# Altium schematic sheet Regulators.SchDoc
size Letter; CompanyName: Ploopy Corporation; Organization: Ploopy Corporation; Address1: Suite 226, 137-1140 Burnhamthorpe Road W; Address2: Mississauga; Address3: Ontario; Address4: Canada L5C 0A3; DocumentNumber: 11; Revision: R1.007; SheetNumber: 11; SheetTotal: 11
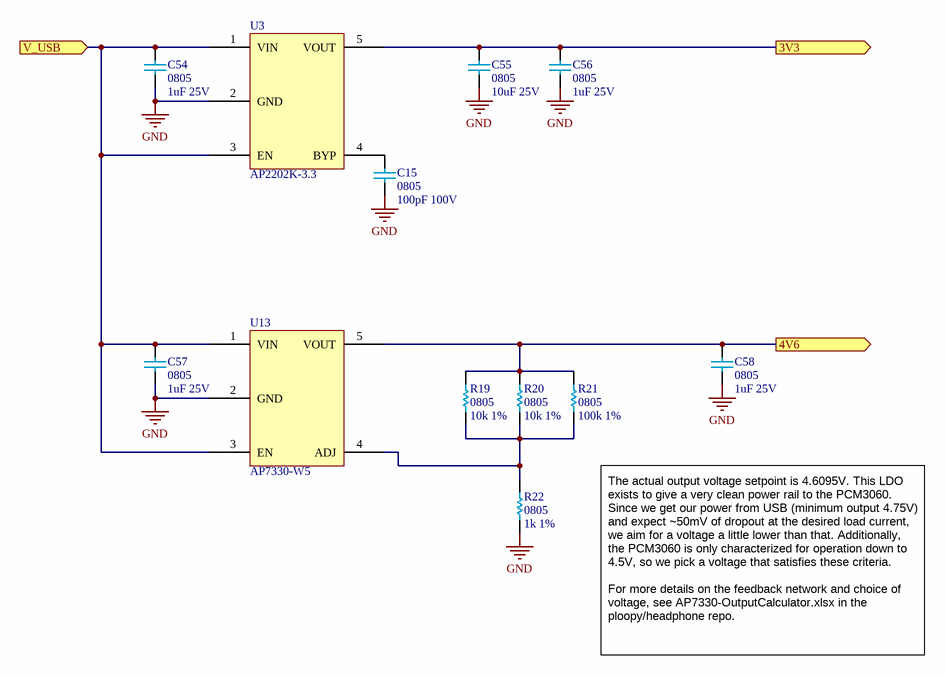
[diagram p0: Regulators.SchDoc]

## Parts
C15  0805  value 100pF 100V  [0805]
C54  0805  value 1uF 25V  [0805]
C55  0805  value 10uF 25V  [0805]
C56  0805  value 1uF 25V  [0805]
C57  0805  value 1uF 25V  [0805]
C58  0805  value 1uF 25V  [0805]
R19  0805  value 10k 1%  [0805]
R20  0805  value 10k 1%  [0805]
R21  0805  value 100k 1%  [0805]
R22  0805  value 1k 1%  [0805]
U3  AP2202K-3.3  [AP2202 - SOT95P270X145-5N]
U13  AP7330-W5  [AP7330-W5 - SOT95P270X145-5N]

## Ports
3V3 (out), 4V6 (out), V_USB (in)

## Nets
GND: C15.1 C54.1 C55.1 C56.1 C57.1 C58.1 R22.1 U3.2(GND) U13.2(GND)
3V3: C55.2 C56.2 U3.5(VOUT) ; port 3V3
4V6: C58.2 R19.2 R20.2 R21.2 U13.5(VOUT) ; port 4V6
V_USB: C54.2 C57.2 U3.1(VIN) U3.3(EN) U13.1(VIN) U13.3(EN) ; port V_USB
NetC15_2: C15.2 U3.4(BYP)
NetR19_1: R19.1 R20.1 R21.1 R22.2 U13.4(ADJ)

## Notes on the sheet
- The actual output voltage setpoint is 4.6095V. This LDO exists to give a very clean power rail to the PCM3060. Since we get our power from USB (minimum output 4.75V) and expect ~50mV of dropout at the desired load current, we aim for a voltage a little lower than that. Additionally, the PCM3060 is only characterized for operation down to 4.5V, so we pick a voltage that satisfies these criteria.
  For more details on the feedback network and choice of voltage, see AP7330-OutputCalculator.xlsx in the ploopy/headphone repo.
- Copyright Ploopy Corporation 2023
- Licensed under the CERN-OHL-S v2
- http://ohwr.org/cernohl
- Title:
- PCB:
- Version:
- Ploopy Corporation
- Mississauga ON L5C 0A3
- 137-1140 Burnhamthorpe Road W
- Date:
- Time:
- Sheet
- of
- Canada

## Library data of the parts
C15 = Cap 100pF 100V: 0805, X5R or better; PNP-Nzl: 2; PNP-dx: 0; PNP-X: 2.00; PNP-Y: 1.25; PNP-Thk: 0.60; PNP-Lv: 1; PNP-TS: 70; PNP-Type: chi; PNP-FeedType: Tape; PNP-TapeWidth: 8; Supplier 1: Digi-Key; Supplier Part Number 1: 1276-2426-1-ND; Supplier 2: Digi-Key; Supplier Part Number 2: 1276-2426-2-ND; PNP-dy: 0; PNP-Pt: 0; PNP-W: 0; PNP-Level: 1; PNP-Voff: 0; PNP-PlacePriority: 1; PNP-A: 0; PNP-TapeIndex: 1; Supplier 3: Arrow; Supplier Part Number 3: L5XIfgkrxsBQF2sGZ85JNyFE59-nywaq7sHwLppiklbTEIlO4Ffw3x4_A6bjf4Mm; PNP-da: 0
C54 C56-C58 = Cap 1uF 25V: 0805, X5R or better; PNP-Nzl: 2; PNP-dx: 0; PNP-Level: 1; PNP-Thk: 1.25; PNP-TS: 70; PNP-Type: chi; PNP-X: 2.00; PNP-FeedType: Tape; PNP-TapeWidth: 8; Supplier 1: Digi-Key; Supplier Part Number 1: 1276-1066-2-ND; Supplier 2: Digi-Key; Supplier Part Number 2: 1276-1066-1-ND; PNP-dy: 0; PNP-Lv: 1; PNP-Pt: 0; PNP-Voff: 0; PNP-W: 0; PNP-Y: 1.25; PNP-A: 0; PNP-PlacePriority: 1; PNP-TapeIndex: 1; PNP-da: 0
C55 = Cap 10uF 25V: 0805, X5R or better; PNP-Nzl: 2; PNP-dx: 0; PNP-X: 2.00; PNP-Y: 1.25; PNP-Lv: 1; PNP-TS: 70; PNP-Type: chi; PNP-FeedType: Tape; PNP-TapeWidth: 8; PNP-dy: 0; PNP-Pt: 0; PNP-W: 0; PNP-Thk: 1.25; PNP-Level: 1; PNP-Voff: 0; PNP-PlacePriority: 1; PNP-A: 0; PNP-TapeIndex: 1; Supplier 1: Mouser; Supplier Part Number 1: 81-GRM21BR61E106KA3L; Supplier 2: Digi-Key; Supplier Part Number 2: 490-5523-1-ND; PNP-da: 0
R19 R20 = Res 10k 1% 0805: Chip resistor; Supplier 1: Digi-Key; Supplier Part Number 1: RMCF0805FT10K0TR-ND
R21 = Res 100k 1% 0805: Chip resistor; Supplier 1: Digi-Key; Supplier 2: Digi-Key; Supplier Part Number 1: RMCF0805FT100KTR-ND; Supplier Part Number 2: RMCF0805FT100KCT-ND
R22 = Res 1k 1% 0805: Chip resistor, 1/8W 100PPM; Supplier 1: Digi-Key; Supplier Part Number 1: RMCF0805FT1K00TR-ND
U3 = AP2202K-3.3: 3.3V 150mA LDO regulator; PNP-Nzl: 2; PNP-dx: 0; PNP-X: 2.9; PNP-Y: 1.3; PNP-A: 90; PNP-Thk: 1; PNP-Lv: 26; PNP-Type: CHP; PNP-FeedType: Tape; PNP-TapeWidth: 8; PNP-PlacePriority: 3; PNP-dy: 0; PNP-Pt: 0; PNP-W: 0; PNP-TS: 90; PNP-Level: 1; PNP-Voff: 0; PNP-TapeIndex: 1; Supplier 1: Mouser; Supplier Part Number 1: 621-AP2202K-3.3TRG1; Supplier 2: Digi-Key; Supplier Part Number 2: AP2202K-3.3TRG1DICT-ND; Supplier 3: Arrow; Supplier Part Number 3: PWagzdsTFFHKE_U17B45SP-NtndBrheJIaI5hB7gHD0ZVywxIBNyoAQstvnyfZZ0; PNP-da: 0
U13 = AP7330-W5: 300mA HIGH PSRR LOW NOISE LDO WITH ENABLE; Supplier 1: Digi-Key; Supplier Part Number 1: AP2202K-ADJTRG1DICT-ND; Supplier 2: Digi-Key; Supplier Part Number 2: 576-1262-1-ND